# EAGLE schematic eX_ESP_Robot (EAGLE 7.1.0)
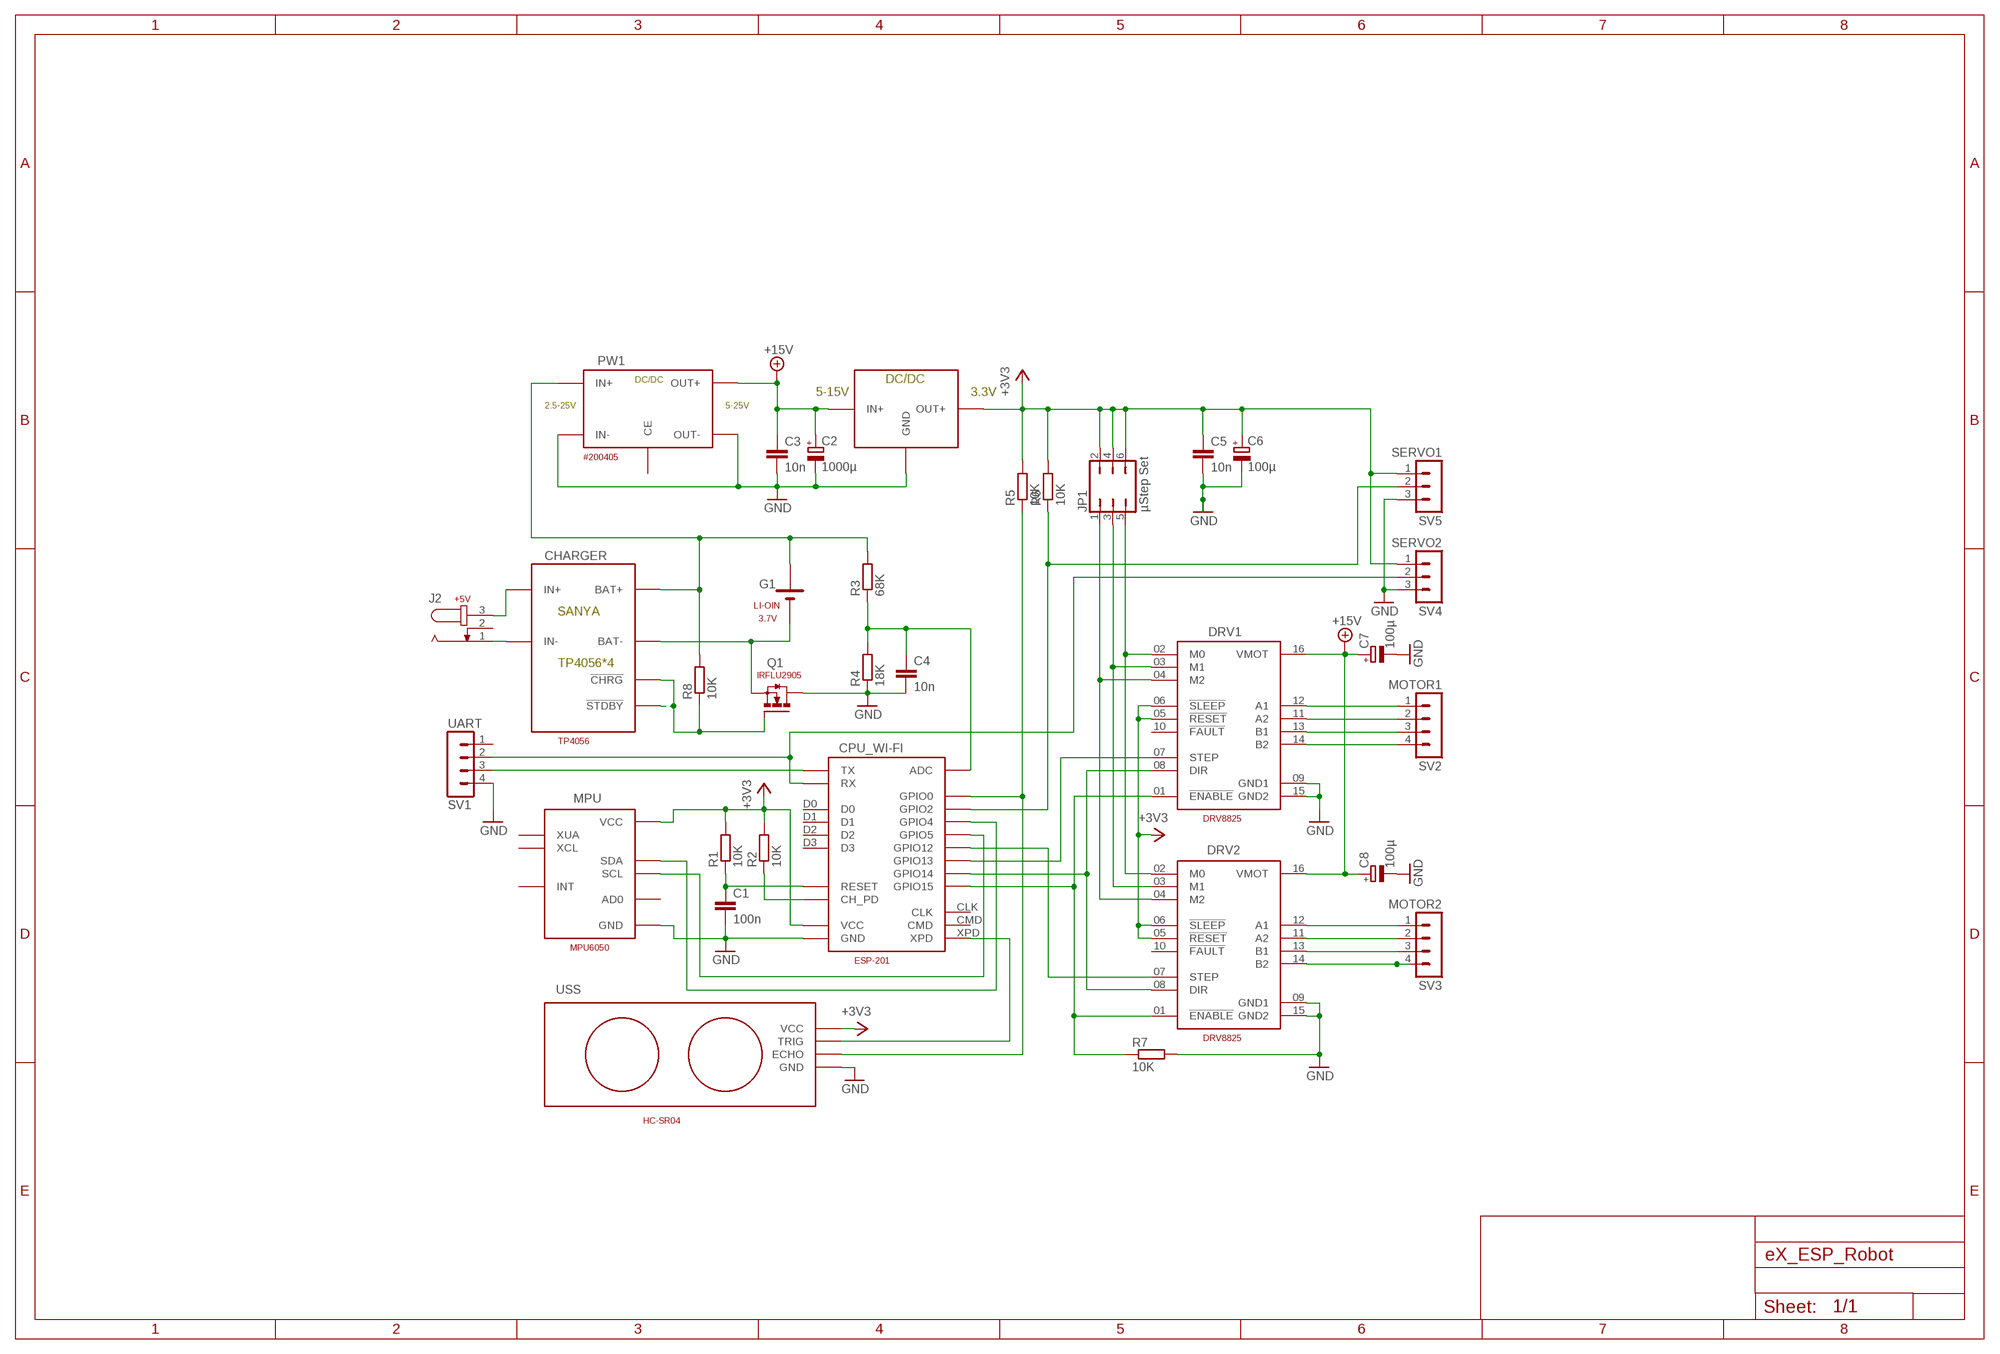
[diagram p0: schematic, sheet 1]

## Parts
C1  100n  C-EU025-024X044  [C025-024X044]
C2  1000µ  CPOL-EUTT6D6  [TT5D6]
C3  10n  C-EU025-025X050  [C025-025X050]
C4  10n  C-EU025-025X050  [C025-025X050]
C5  10n  C-EU025-025X050  [C025-025X050]
C6  100µ  CPOL-EUTT6D6  [TT5D6]
C7  100µ  CPOL-EUTT2D4  [TT2D4]
C8  100µ  CPOL-EUTT2D4  [TT2D4]
CHARGER  TP4056  [TP4056]
CPU_WI-FI  ESP-201  [ESP-201]
DRV1  DRV8825  [DRV8825]
DRV2  DRV8825  [DRV8825]
G1  LI-OIN  [LI-ION]
J2  +5V  JACK-PLUG0  [SPC4077]
JP1  µStep Set  JP3Q  [JP3Q]
MPU  MPU-6050  [MPU-6050]
PW1  #200405  [#200405]
Q1  N-HEXFET-2D_SOT232-IRLL2705  [SOT223]
R1  10K  R-EU_0204/5  [0204/5]
R2  10K  R-EU_0204/5  [0204/5]
R3  68K  R-EU_0204/5  [0204/5]
R4  18K  R-EU_0204/5  [0204/5]
R5  10K  R-EU_0204/5  [0204/5]
R6  10K  R-EU_0204/5  [0204/5]
R7  10K  R-EU_0204/5  [0204/5]
R8  10K  R-EU_0204/5  [0204/5]
SV1  UART  MA04-1  [MA04-1]
SV2  MOTOR1  MA04-1  [MA04-1]
SV3  MOTOR2  MA04-1  [MA04-1]
SV4  SERVO2  MA03-1  [MA03-1]
SV5  SERVO1  MA03-1  [MA03-1]
U$1  YCO6001-3.3  [YCO6001-3.3]
USS  HC-SR04  [HC-SR04_FOOTPRINT]

## Nets
!RES: C1.1 CPU_WI-FI.RST(RESET) R1.1
+3V3: C5.1 C6.+ CPU_WI-FI.3V3(VCC) CPU_WI-FI.3V3_2(VCC) CPU_WI-FI.3V3_3(VCC) DRV1.05(!RESET) DRV1.06(!SLEEP) DRV2.05(!RESET) DRV2.06(!SLEEP) JP1.2 JP1.4 JP1.6 MPU.VCC R1.2 R2.2 R5.2 R6.2 SV4.1 SV5.1 U$1.OUT+1(OUT+) U$1.OUT+2(OUT+) USS.VCC
+15V: C2.+ C3.1 C7.+ C8.+ DRV1.16(VMOT) DRV2.16(VMOT) PW1.OUT+1(OUT+) PW1.OUT+2(OUT+) U$1.IN+1(IN+) U$1.IN+2(IN+)
BAT+: CHARGER.B+(BAT+) G1.+1(+) G1.+2(+) PW1.IN+1(IN+) PW1.IN+2(IN+) PW1.IN+3(IN+) R3.2 R8.2
GND: C1.2 C2.- C3.2 C4.2 C5.2 C6.- C7.- C8.- CPU_WI-FI.GND CPU_WI-FI.GND_2(GND) CPU_WI-FI.GND_3(GND) DRV1.09(GND1) DRV1.15(GND2) DRV2.09(GND1) DRV2.15(GND2) MPU.GND PW1.-IN1(IN-) PW1.-IN2(IN-) PW1.-IN3(IN-) PW1.-OUT1(OUT-) PW1.-OUT2(OUT-) PW1.-OUT3(OUT-) Q1.2(D) Q1.4(D) R4.1 R7.2 SV1.4 SV4.3 SV5.3 U$1.IN-(GND) U$1.OUT-(GND) USS.GND
N$1: CPU_WI-FI.TX SV1.3
N$2: CHARGER.5V-(IN-) J2.1
N$3: DRV2.12(A1) SV3.1
N$4: DRV2.11(A2) SV3.2
N$5: CPU_WI-FI.GPIO5 MPU.SCL
N$6: CPU_WI-FI.CH_PD R2.1
N$7: DRV2.13(B1) SV3.3
N$8: DRV2.14(B2) SV3.4
N$9: DRV1.14(B2) SV2.4
N$10: DRV1.13(B1) SV2.3
N$11: DRV1.11(A2) SV2.2
N$12: DRV1.12(A1) SV2.1
N$14: DRV1.02(M0) DRV2.02(M0) JP1.5
N$15: DRV1.03(M1) DRV2.03(M1) JP1.3
N$16: DRV1.04(M2) DRV2.04(M2) JP1.1
N$17: CPU_WI-FI.GPIO14 DRV1.08(DIR) DRV2.08(DIR)
N$18: CPU_WI-FI.GPIO2 R6.1 SV5.2
N$19: CPU_WI-FI.GPIO4 MPU.SDA
N$20: CPU_WI-FI.GPIO15 DRV1.01(!ENABLE) DRV2.01(!ENABLE) R7.1
N$21: CPU_WI-FI.GPIO13 DRV1.07(STEP)
N$22: CPU_WI-FI.GPIO12 DRV2.07(STEP)
N$23: CHARGER.5V+(IN+) CHARGER.V+(IN+) J2.3
N$24: C4.1 CPU_WI-FI.ADC R3.1 R4.2
N$25: CPU_WI-FI.XPD USS.TRIG
N$26: CPU_WI-FI.GPIO0 R5.1 USS.ECHO
N$27: CHARGER.G(!STDBY) CHARGER.R(!CHRG) Q1.1(G) R8.1
N$29: CHARGER.B-(BAT-) G1.-1(-) G1.-2(-) Q1.3(S)
RX: CPU_WI-FI.RX SV1.2 SV4.2
Unconnected: CPU_WI-FI.CLK CPU_WI-FI.CMD CPU_WI-FI.D0 CPU_WI-FI.D1 CPU_WI-FI.D2 CPU_WI-FI.D3 DRV1.10(!FAULT) DRV2.10(!FAULT) J2.2 MPU.AD0 MPU.INT MPU.XCL MPU.XDA(XUA) PW1.ON/OFF(CE) SV1.1

## Library data of the parts
C1 C3-C5 = rcl:C-EU: CAPACITOR, European symbol
C2 C6-C8 = rcl:CPOL-EU: POLARIZED CAPACITOR, European symbol
CHARGER = Charger TP4056 x 4:TP4056
CPU_WI-FI = esp8266modules:ESP-201: ESP8266 Wifi Module ESP-201; DIMENSIONS: 25 x 35 mm; PINS: 26; PITCH: 0.1" / 2.54 mm
DRV1 DRV2 = pololu:DRV8825: DRV8825 STEPPER MOTOR DRIVE
G1 = Battery Li-Ion:LI-OIN; VOLTAGE: 3.7V
J2 = con-jack:JACK-PLUG: DC POWER JACK Power Jack, DC, Right Angle, Through Hole, Rated 5A at 16VDC, PC Terminals Distributor: Farnell (www.Farnell.de) Drawing: 84N1161.pdf / 84N1162.pdf Manufacturer: SPC Technology (www.spctechnology.com) Type: SPC4077 / SPC 4078; OC_FARNELL: unknown; OC_NEWARK: unknown
JP1 = jumper:JP3Q: JUMPER
MPU = MPU6050:MPU-6050: Triple Axis Accelerometer and Gyro Breakout
PW1 = DC-DC_converter:#200405
Q1 = transistor-power:N-HEXFET-2D_?-*: HEXFET® Power MOSFET 2 Drain connects http://www.irf.com/product-info/datasheets/data/irll014n.pdf; TYPE: IRFLU2905
R1-R8 = rcl:R-EU_: RESISTOR, European symbol
SV1-SV3 = con-lstb:MA04-1: PIN HEADER; OC_FARNELL: unknown; OC_NEWARK: unknown
SV4 SV5 = con-lstb:MA03-1: PIN HEADER; OC_FARNELL: unknown; OC_NEWARK: unknown
U$1 = DC-DC_converter:YCO6001-3.3
USS = Ultrasonic Sensor HC-SR04:HC-SR04: Ultrasonic Sensor HC-SR04